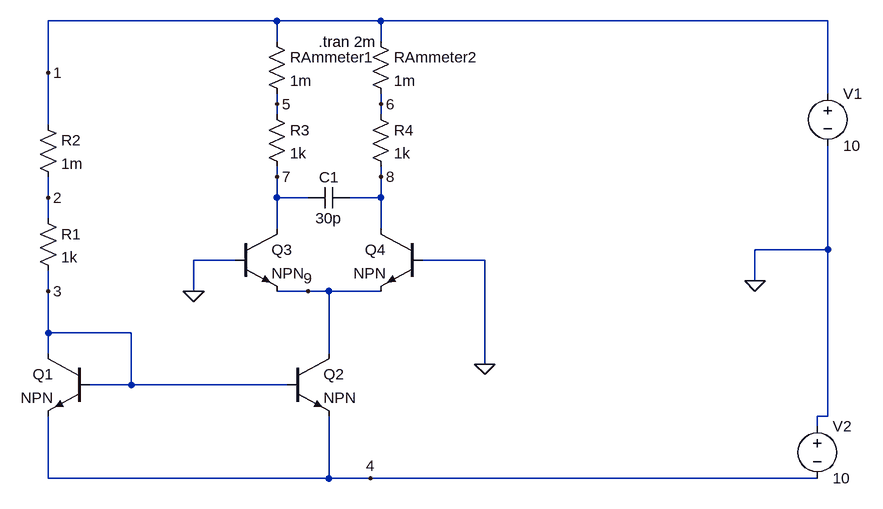
[diagram p0: schematic Lab.asc]
Lab.asc, the LTspice schematic file:
Version 4
SHEET 1 1164 716
WIRE 256 -32 -96 -32
WIRE 416 -32 256 -32
WIRE 1104 -32 416 -32
WIRE 256 0 256 -32
WIRE 416 0 416 -32
WIRE -96 48 -96 -32
WIRE 1104 80 1104 -32
WIRE 256 96 256 80
WIRE 416 96 416 80
WIRE 256 112 256 96
WIRE 416 112 416 96
WIRE -96 128 -96 48
WIRE 256 208 256 192
WIRE 416 208 416 192
WIRE -96 240 -96 208
WIRE 256 240 256 208
WIRE 304 240 256 240
WIRE 416 240 416 208
WIRE 416 240 368 240
WIRE -96 272 -96 240
WIRE 256 288 256 240
WIRE 416 288 416 240
WIRE 1104 320 1104 160
WIRE 1104 320 992 320
WIRE 192 336 128 336
WIRE 576 336 480 336
WIRE 992 368 992 320
WIRE -96 384 -96 352
WIRE 128 384 128 336
WIRE 304 384 256 384
WIRE 336 384 304 384
WIRE 416 384 336 384
WIRE -96 448 -96 384
WIRE 32 448 -96 448
WIRE -96 480 -96 448
WIRE 336 480 336 384
WIRE 576 496 576 336
WIRE 32 528 32 448
WIRE 32 528 -32 528
WIRE 272 528 32 528
WIRE 1104 576 1104 320
WIRE 1104 576 1088 576
WIRE 1088 592 1088 576
WIRE -96 672 -96 576
WIRE 336 672 336 576
WIRE 336 672 -96 672
WIRE 400 672 336 672
WIRE 1088 672 400 672
FLAG 992 368 0
FLAG 128 384 0
FLAG 576 496 0
FLAG -96 48 1
FLAG 416 208 8
FLAG 304 384 9
FLAG -96 240 2
FLAG -96 384 3
FLAG 256 96 5
FLAG 416 96 6
FLAG 256 208 7
FLAG 400 672 4
SYMBOL res -112 256 R0
SYMATTR InstName R1
SYMATTR Value 1k
SYMBOL npn -32 480 M0
SYMATTR InstName Q1
SYMBOL cap 368 224 R90
WINDOW 0 0 32 VBottom 2
WINDOW 3 32 32 VTop 2
SYMATTR InstName C1
SYMATTR Value 30p
SYMBOL res -112 112 R0
SYMATTR InstName R2
SYMATTR Value 1m
SYMBOL res 240 96 R0
SYMATTR InstName R3
SYMATTR Value 1k
SYMBOL res 400 96 R0
SYMATTR InstName R4
SYMATTR Value 1k
SYMBOL voltage 1104 64 R0
SYMATTR InstName V1
SYMATTR Value 10
SYMBOL voltage 1088 576 R0
SYMATTR InstName V2
SYMATTR Value 10
SYMBOL res 240 -16 R0
SYMATTR InstName RAmmeter1
SYMATTR Value 1m
SYMBOL res 400 -16 R0
SYMATTR InstName RAmmeter2
SYMATTR Value 1m
SYMBOL npn 192 288 R0
SYMATTR InstName Q3
SYMBOL npn 480 288 M0
SYMATTR InstName Q4
SYMBOL npn 272 480 R0
SYMATTR InstName Q2
TEXT 320 0 Left 2 !.tran 2m

The netlist it stands for:
* Lab.asc
R1 2 3 1k
Q1 3 3 4 0 NPN
C1 8 7 30p
R2 1 2 1m
R3 5 7 1k
R4 6 8 1k
V1 1 0 10
V2 0 4 10
RAmmeter1 1 5 1m
RAmmeter2 1 6 1m
Q3 7 0 9 0 NPN
Q4 8 0 9 0 NPN
Q2 9 3 4 0 NPN
.model NPN NPN
.model PNP PNP
.lib standard.bjt
.tran 2m
.backanno
.end